# EAGLE design oven (EAGLE 6.1)
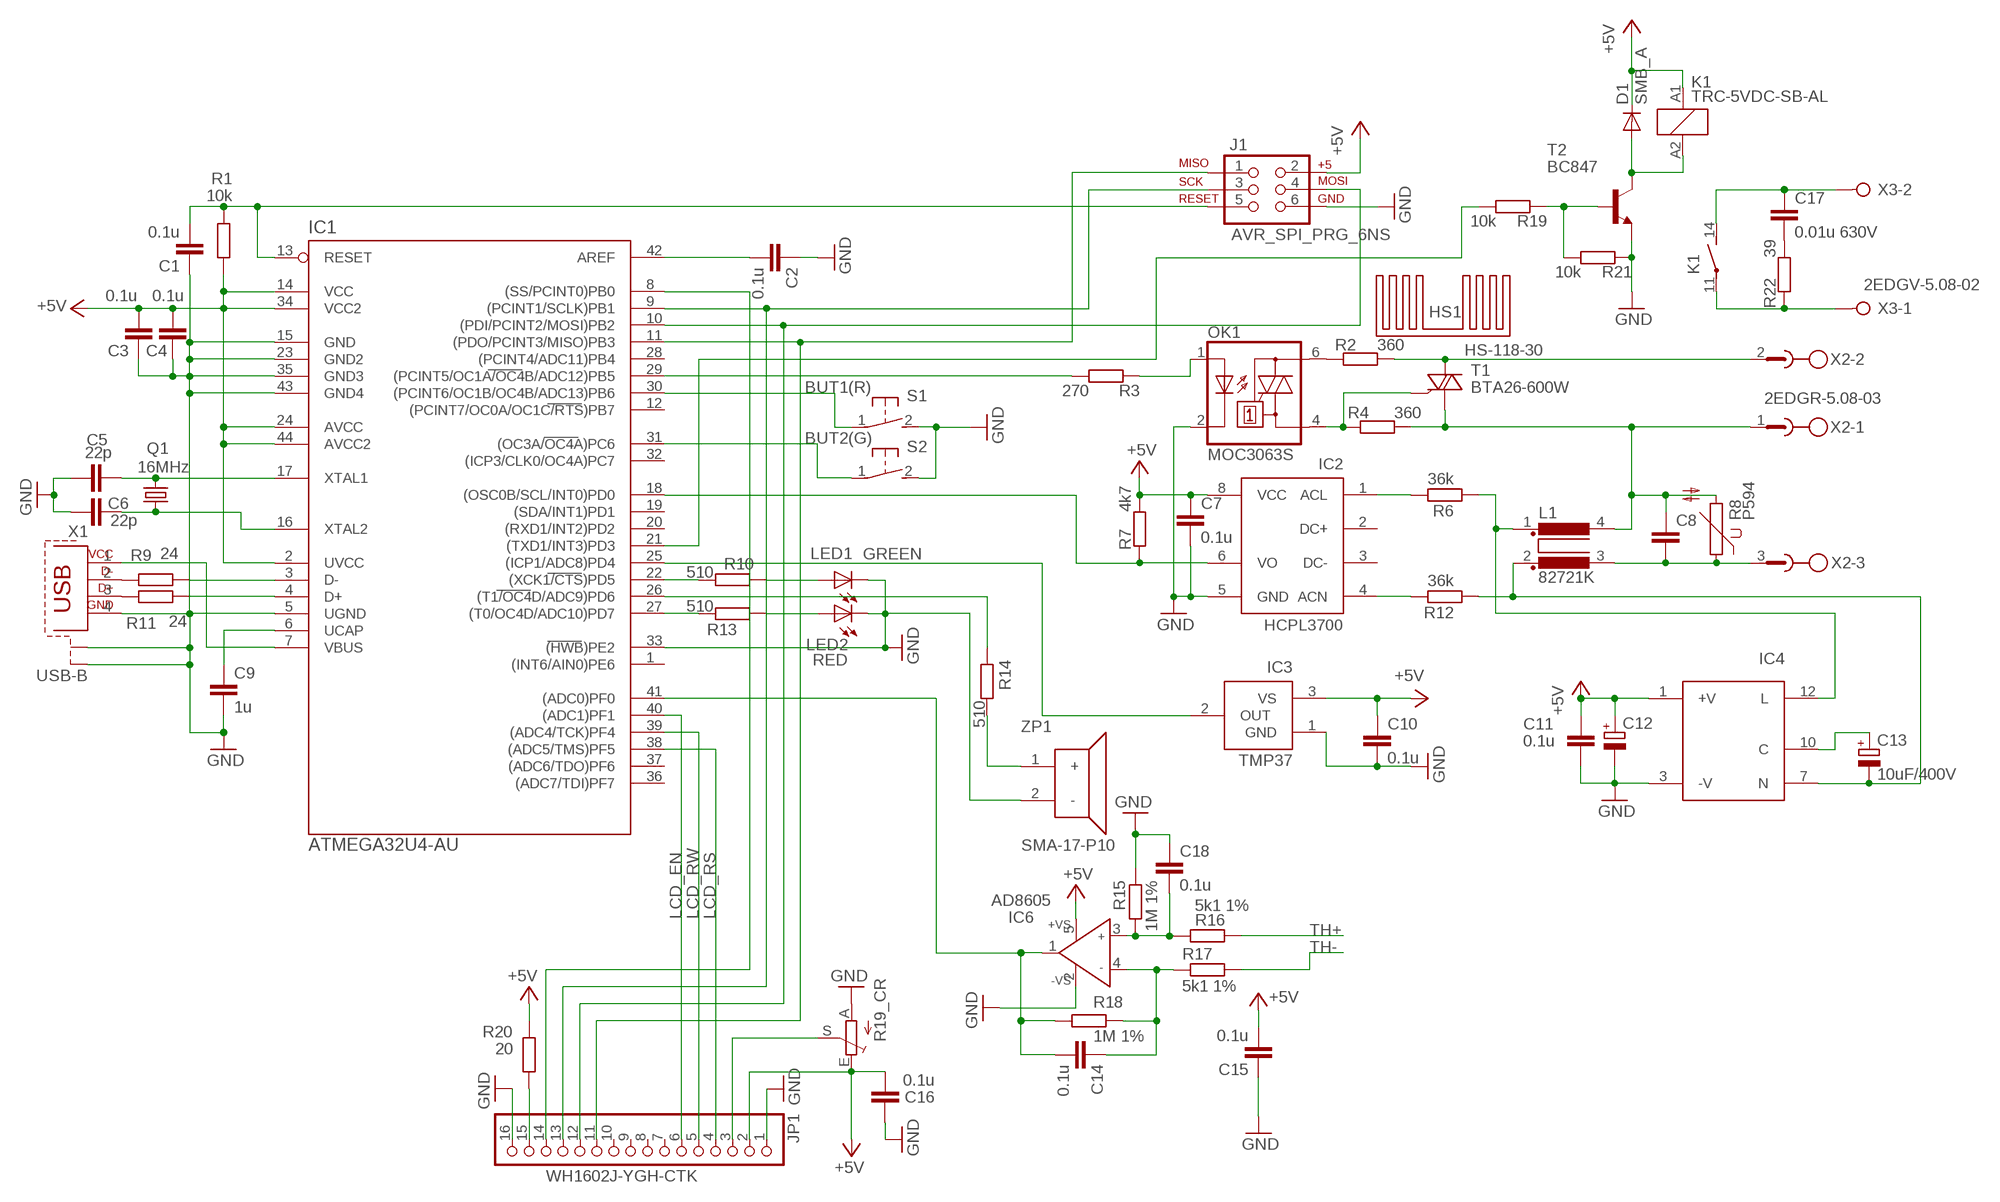
[diagram p0: schematic, sheet 1]

## Parts
C1  0.1u  C-EUC0805R  [C0805R]
C2  0.1u  C-EUC0805R  [C0805R]
C3  0.1u  C-EUC0805R  [C0805R]
C4  0.1u  C-EUC0805R  [C0805R]
C5  22p  C-EUC0805R  [C0805R]
C6  22p  C-EUC0805R  [C0805R]
C7  0.1u  C-EUC0805R  [C0805R]
C8  C-EU102-054X133  [C102-054X133]
C9  1u  C-EUC0805R  [C0805R]
C10  0.1u  C-EUC0805R  [C0805R]
C11  0.1u  C-EUC0805R  [C0805R]
C12  CPOL-EUE3.5-8  [E3,5-8]
C13  10uF/400V  CPOL-EUE5-10.5  [E5-10,5]
C14  0.1u  C-EUC0805R  [C0805R]
C15  0.1u  C-EUC0805R  [C0805R]
C16  0.1u  C-EUC0805R  [C0805R]
C17  0.01u 630V  C-EU102-043X133  [C102-043X133]
C18  0.1u  C-EUC0805R  [C0805R]
D1  SMB_A  DIODE-DO-214AC  [DO-214AC]
HS1  HS-118-30  HS-118  [HS-118]
IC1  ATMEGA32U4-AU  [TQFP44]
IC2  HCPL3700  [DIL08]
IC3  TMP37  TMP36  [TO92]
IC4  PPM2.5-S12-05ELF  [SIP12]
IC6  AD8605  [SOT23-5]
J1  AVR_SPI_PRG_6NS  [2X3-NS]
JP1  WH1602J-YGH-CTK  PINHD-1X16  [1X16]
K1  TRC-5VDC-SB-AL  TRCA  [TRC]
L1  82721K  [82721K]
LED1  GREEN  LED3MM  [LED3MM]
LED2  RED  LED3MM  [LED3MM]
OK1  MOC3063S  MOC3043S  [DIL6-SMD]
Q1  16MHz  CRYSTALHC49S  [HC49/S]
R1  10k  R-EU_R0805R  [R0805R]
R2  360  R-EU_R2512  [R2512]
R3  270  R-EU_R0805R  [R0805R]
R4  360  R-EU_R2512  [R2512]
R6  36k  R-EU_R1206R  [R1206R]
R7  4k7  R-EU_R0805R  [R0805R]
R8  P594  [P594]
R9  24  R-EU_R0805R  [R0805R]
R10  510  R-EU_R0805R  [R0805R]
R11  24  R-EU_R0805R  [R0805R]
R12  36k  R-EU_R1206R  [R1206R]
R13  510  R-EU_R0805R  [R0805R]
R14  510  R-EU_R0805R  [R0805R]
R15  1M 1%  R-EU_R0805R  [R0805R]
R16  5k1 1%  R-EU_R0805R  [R0805R]
R17  5k1 1%  R-EU_R0805R  [R0805R]
R18  1M 1%  R-EU_R0805R  [R0805R]
R19  10k  R-EU_R0805R  [R0805R]
R19_CR  TRIM_EU-CA6V  [CA6V]
R20  20  R-EU_R0805R  [R0805R]
R21  10k  R-EU_R0805R  [R0805R]
R22  39  R-EU_0207/5V  [0207/5V]
S1  31-XX  [B3F-31XX]
S2  31-XX  [B3F-31XX]
T1  BTA26-600W  BTA26-V  [TOP3S-1]
T2  BC847  [SOT23]
X1  USB-B  [PN61729-S]
X2  2EDGR-5.08-03  W232-3  [W232-3]
X3  2EDGV-5.08-02  W237-02P  [W237-132]
ZP1  SMA-17-P10  [SMA-17]

## Nets
+5V: C3.2 C4.2 C7.1 C10.1 C11.1 C12.+ C15.2 C16.2 D1.C IC1.2(UVCC) IC1.14(VCC) IC1.24(AVCC) IC1.34(VCC2) IC1.44(AVCC2) IC2.8(VCC) IC3.3(VS) IC4.1(+V) IC6.5(+VS) J1.2 JP1.2 K1.A1 R1.1 R7.2 R19_CR.E R20.1
BUT1(R): IC1.30((PCINT6/OC1B/OC4B/ADC13)PB6) S1.1(P)
BUT2(G): IC1.31((OC3A/OC4A)PC6) S2.1(P)
GND: C1.1 C2.1 C3.1 C4.1 C5.1 C6.1 C7.2 C9.2 C10.2 C11.2 C12.- C15.1 C16.1 C18.1 IC1.5(UGND) IC1.15(GND) IC1.23(GND2) IC1.33((HWB)PE2) IC1.35(GND3) IC1.43(GND4) IC2.5(GND) IC3.1(GND) IC4.3(-V) IC6.2(-VS) J1.6 JP1.1 JP1.16 LED1.K(C) LED2.K(C) OK1.2(C) R15.2 R19_CR.A R21.1 S1.2(S) S2.2(S) T2.2(E) X1.4 X1.S1 X1.S2 ZP1.2(-)
LCD_D4: IC1.11((PDO/PCINT3/MISO)PB3) J1.1 JP1.11
LCD_D5: IC1.10((PDI/PCINT2/MOSI)PB2) J1.4 JP1.12
LCD_D6: IC1.9((PCINT1/SCLK)PB1) J1.3 JP1.13
LCD_D7: IC1.8((SS/PCINT0)PB0) JP1.14
LCD_EN: IC1.40((ADC1)PF1) JP1.6
LCD_RS: IC1.38((ADC5/TMS)PF5) JP1.4
LCD_RW: IC1.39((ADC4/TCK)PF4) JP1.5
N$1: C9.1 IC1.6(UCAP)
N$2: R9.1 X1.2
N$3: R11.1 X1.3
N$4: IC1.3(D-) R9.2
N$5: IC1.4(D+) R11.2
N$6: IC1.7(VBUS) X1.1
N$7: IC1.18((OSC0B/SCL/INT0)PD0) IC2.6(VO) R7.1
N$8: C5.2 IC1.17(XTAL1) Q1.2
N$9: C6.2 IC1.16(XTAL2) Q1.1
N$10: IC1.29((PCINT5/OC1A/OC4B/ADC12)PB5) R3.2
N$11: C1.2 IC1.13(RESET) J1.5 R1.2
N$12: C2.2 IC1.42(AREF)
N$13: C17.2 R22.2
N$16: OK1.1(A) R3.1
N$17: OK1.6(A2) R2.1
N$18: OK1.4(A1) R4.1 T1.G
N$19: R2.2 T1.A2 X2.2
N$20: IC4.12(L) L1.1 R6.1
N$21: JP1.15 R20.2
N$22: IC1.25((ICP1/ADC8)PD4) IC3.2(OUT)
N$23: IC2.4(ACN) R12.2
N$25: C14.2 IC1.41((ADC0)PF0) IC6.1(OUT) R18.1
N$26: C18.2 IC6.3(IN+) R15.1 R16.1
N$27: C14.1 IC6.4(IN-) R17.1 R18.2
N$29: IC2.1(ACL) R6.2
N$30: LED1.A R10.1
N$31: C13.+ IC4.10(C)
N$32: IC1.22((XCK1/CTS)PD5) R10.2
N$33: IC1.26((T1/OC4D/ADC9)PD6) R14.1
N$34: IC1.27((T0/OC4D/ADC10)PD7) R13.2
N$36: LED2.A R13.1
N$37: C13.- IC4.7(N) L1.2 R12.1
N$38: C8.1 L1.4 R4.2 R8.2 T1.A1 X2.1
N$39: C8.2 L1.3 R8.1 X2.3
N$40: JP1.3 R19_CR.S
N$42: D1.A K1.A2 T2.3(C)
N$43: R19.1 R21.2 T2.1(B)
N$44: R14.2 ZP1.1(+)
N$45: C17.1 K1.14(2:S) X3.2
N$46: IC1.21((TXD1/INT3)PD3) R19.2
N$47: K1.11(2:P) R22.1 X3.1
TH+: R16.2
TH-: R17.2
Unconnected: IC1.1((INT6/AIN0)PE6) IC1.12((PCINT7/OC0A/OC1C/RTS)PB7) IC1.19((SDA/INT1)PD1) IC1.20((RXD1/INT2)PD2) IC1.28((PCINT4/ADC11)PB4) IC1.32((ICP3/CLK0/OC4A)PC7) IC1.36((ADC7/TDI)PF7) IC1.37((ADC6/TDO)PF6) IC2.2(DC+) IC2.3(DC-) JP1.7 JP1.8 JP1.9 JP1.10

## Library data of the parts
C1-C11 C14-C18 = olegart-passive:C-EU: CAPACITOR, European symbol
C12 C13 = olegart-passive:CPOL-EU: POLARIZED CAPACITOR, European symbol
D1 = diode:DIODE-: DIODE
HS1 = heatsinks:HS-118: Kinsten HS-118 heatsink
IC1 = mega32U4:ATMEGA32U4-AU
IC2 = olegart-ic:HCPL3700: AC/DC to Logic Interface Optocoupler
IC3 = olegart-ic:TMP36: TMP36 temperature sensor
IC4 = olegart-ic:PPM2.5-S12-05ELF: Peak PPM2.5-S12-05ELF AC/DC conerter, 5V 500mA
IC6 = olegart-ic:AD8605: High Gain Bandwidth, Precision Fast FET(TM) Op Amp Source: http://www.analog.com/UploadedFiles/Data_Sheets/346131962AD8067_a.pdf
J1 = olegart-connectors:AVR_SPI_PRG_6: AVR ISP 6 Pin This is the reduced ISP connector for AVR programming. Common on Arduino. This footprint will take up less PCB space and can be used with a 10-pin to 6-pin adapter such as SKU: BOB-08508
JP1 = pinhead:PINHD-1X16: PIN HEADER
K1 = olegart-relays:TRC: TRC-5VDC-SB-AL (TS)
L1 = inductors:82721K: FILTER
LED1 LED2 = olegart-opto:LED: LED OSRAM: - CHIPLED LG R971, LG N971, LY N971, LG Q971, LY Q971, LO R971, LY R971 LH N974, LH R974 LS Q976, LO Q976, LY Q976 LO Q996 - Hyper CHIPLED LW Q18S LB Q993, LB Q99A, LB R99A - SideLED LS A670, LO A670, LY A670, LG A670, LP A670 LB A673, LV A673, LT A673, LW A673 LH A674 LY A675 LS A676, LA A676, LO A676, LY A676, LW A676 LS A679, LY A679, LG A679 - Hyper Micro SIDELED® LS Y876, LA Y876, LO Y876, LY Y876 LT Y87S - SmartLED LW L88C, LW L88S LB L89C, LB L89S, LG L890 LS L89K, LO L89K, LY L89K LS L896, LA L896, LO L896, LY L896 - TOPLED LS T670, LO T670, LY T670, LG T670, LP T670 LSG T670, LSP T670, LSY T670, LOP T670, LYG T670 LG T671, LOG T671, LSG T671 LB T673, LV T673, LT T673, LW T673 LH T674 LS T676, LA T676, LO T676, LY T676, LB T676, LH T676, LSB T676, LW T676 LB T67C, LV T67C, LT T67C, LS T67K, LO T67K, LY T67K, LW E67C LS E67B, LA E67B, LO E67B, LY E67B, LB E67C, LV E67C, LT E67C LW T67C LS T679, LY T679, LG T679 LS T770, LO T770, LY T770, LG T770, LP T770 LB T773, LV T773, LT T773, LW T773 LH T774 LS E675, LA E675, LY E675, LS T675 LS T776, LA T776, LO T776, LY T776, LB T776 LHGB T686 LT T68C, LB T68C - Hyper Mini TOPLED® LB M676 - Mini TOPLED Santana® LG M470 LS M47K, LO M47K, LY M47K Source: http://www.osram.convergy.de LUXEON: - LUMILED® LXK2-PW12-R00, LXK2-PW12-S00, LXK2-PW14-U00, LXK2-PW14-V00 LXK2-PM12-R00, LXK2-PM12-S00, LXK2-PM14-U00 LXK2-PE12-Q00, LXK2-PE12-R00, LXK2-PE12-S00, LXK2-PE14-T00, LXK2-PE14-U00 LXK2-PB12-K00, LXK2-PB12-L00, LXK2-PB12-M00, LXK2-PB14-N00, LXK2-PB14-P00, LXK2-PB14-Q00 LXK2-PR12-L00, LXK2-PR12-M00, LXK2-PR14-Q00, LXK2-PR14-R00 LXK2-PD12-Q00, LXK2-PD12-R00, LXK2-PD12-S00 LXK2-PH12-R00, LXK2-PH12-S00 LXK2-PL12-P00, LXK2-PL12-Q00, LXK2-PL12-R00 Source: www.luxeon.com KINGBRIGHT: KA-3528ASYC Source: www.kingbright.com
OK1 = optocoupler:MOC30*: 6-Pin DIP Zero-Cross Optoisolators Triac Driver Output (250/400 Volt Peak) Source: http://www.fairchildsemi.com/ds/MO/MOC3043-M.pdf; MF: FAIRCHILD SEMICONDUCTOR; MPN: MOC3043SM; OC_FARNELL: 1505441; OC_NEWARK: 78K6091
Q1 = crystal:CRYSTAL: CRYSTAL; OC_FARNELL: 1667008; OC_NEWARK: unknown
R1-R4 R6 R7 R9-R22 = olegart-passive:R-EU_: RESISTOR, European symbol
R8 = varistor:P594: VARISTOR
R19_CR = pot:TRIM_EU-: POTENTIOMETER
S1 S2 = switch-omron:31-XX: OMRON SWITCH; MPN: B3F-3100; OC_FARNELL: 959704; OC_NEWARK: 36M3582
T1 = triac:BTA26: 25A TRIAC Source: http://www.st.com/stonline/products/literature/ds/7470.pdf
T2 = olegart-transistors:BC847: NPN TRANSISTOR
X1 = olegart-connectors:USB-B: B type USB connector; OC_FARNELL: unknown; OC_NEWARK: unknown
X2 = con-wago-508:W232-3: WAGO SREW CLAMP; OC_FARNELL: unknown; OC_NEWARK: unknown
X3 = con-wago-508:W237-02P: WAGO SREW CLAMP; OC_FARNELL: unknown; OC_NEWARK: unknown
ZP1 = olegart-ic:SMA-17: Sonitron buzzer with generator Compatible with SMA-13-P10

## Board
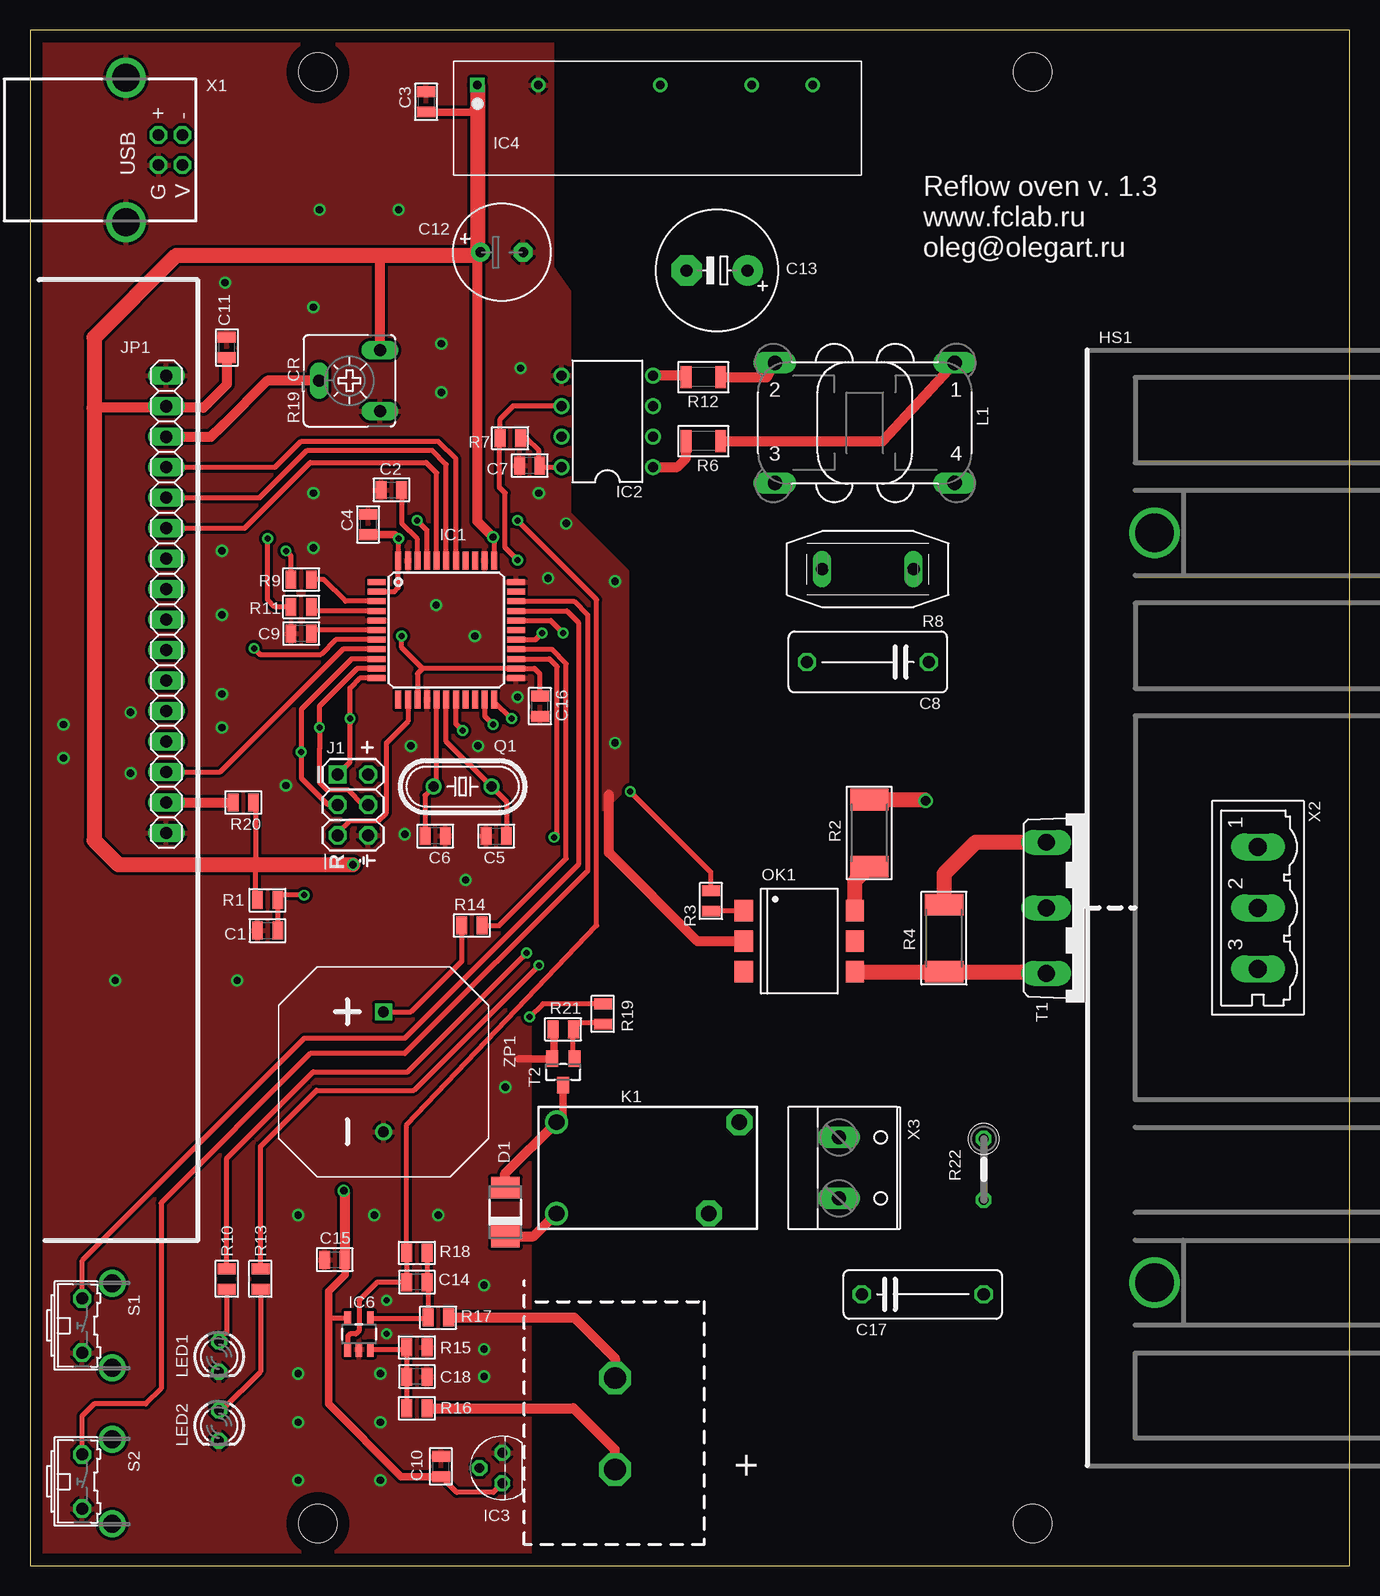
[diagram p1: board, top side]
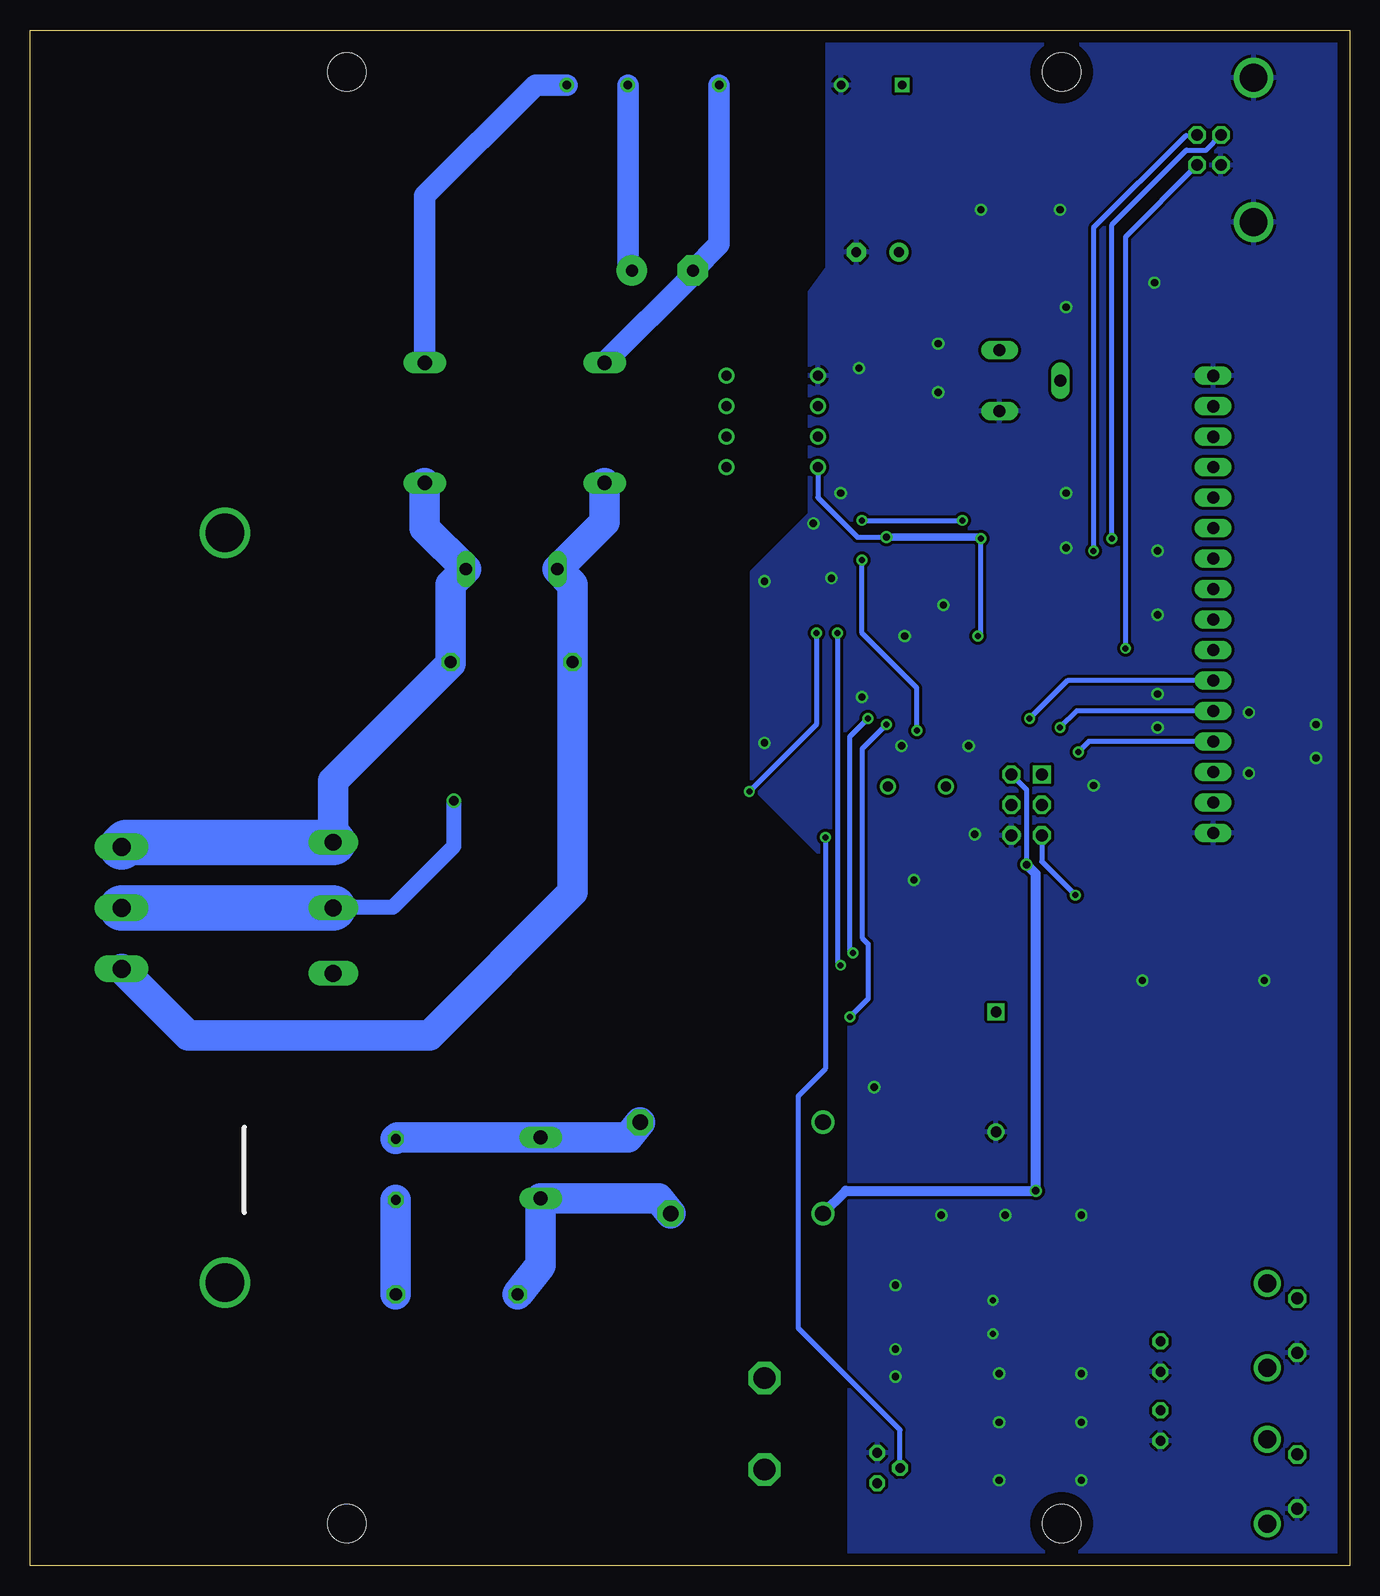
[diagram p2: board, bottom side, seen from below]

Size 110 x 128 mm. Coordinates in mm from the lower left corner, seen from the top.
Outline: 0,0 110,0 110,128 0,128 0,0
Copper layers (1*16): Top 0.035mm / dielectric 1.5mm / Bottom 0.035mm
Design rules: minimum track width 10mil, minimum drill 0.5mm, track to track 0.25mm, track to pad 0.25mm, pad to pad 0.25mm, via to via 0.25mm, smd to smd 0.25mm, copper to edge 40mil, drill to drill 8mil, minimum pad ring 10mil, minimum via ring 8mil, stop-mask expansion 4mil, vias tented up to drill 0.65mm, thermal gap 10mil
Holes 3.2 mm at 24,3.5 24,124.5 83.6,124.5 83.6,3.5

### Footprints (pad centres in the part's own frame; a part is rotated, then mirrored left to right if it is on the bottom)
C0805R = smd 0.9 x 1.5: 1 -0.85,0; 2 0.85,0
C102-054X133 = drill 1.016 octagon: 1 -5.08,0; 2 5.08,0
E3,5-8 = drill 0.813 pad 1.6: + -1.778,0 | drill 0.813 pad 1.6 octagon: - 1.778,0
E5-10,5 = drill 1.016 pad 2.54: + -2.54,0 | drill 1.016 pad 2.54 octagon: - 2.54,0
C102-043X133 = drill 1.016 octagon: 1 -5.08,0; 2 5.08,0
DO-214AC = smd 1.8 x 2.4: A 2.025,0; C -2.025,0
HS-118 = drill 3.2: P$1 -31.25,5.6; P$2 31.25,5.6
TQFP44 = smd 1.5 x 0.5: 1 -5.8,4; 2 -5.8,3.2; 3 -5.8,2.4; 4 -5.8,1.6; 5 -5.8,0.8; 6 -5.8,0; 7 -5.8,-0.8; 8 -5.8,-1.6; 9 -5.8,-2.4; 10 -5.8,-3.2; 11 -5.8,-4; 23 5.8,-4; 24 5.8,-3.2; 25 5.8,-2.4; 26 5.8,-1.6; 27 5.8,-0.8; 28 5.8,0; 29 5.8,0.8; 30 5.8,1.6; 31 5.8,2.4; 32 5.8,3.2; 33 5.8,4 | smd 0.5 x 1.5: 12 -4,-5.8; 13 -3.2,-5.8; 14 -2.4,-5.8; 15 -1.6,-5.8; 16 -0.8,-5.8; 17 0,-5.8; 18 0.8,-5.8; 19 1.6,-5.8; 20 2.4,-5.8; 21 3.2,-5.8; 22 4,-5.8; 34 4,5.8; 35 3.2,5.8; 36 2.4,5.8; 37 1.6,5.8; 38 0.8,5.8; 39 0,5.8; 40 -0.8,5.8; 41 -1.6,5.8; 42 -2.4,5.8; 43 -3.2,5.8; 44 -4,5.8
DIL08 = drill 0.813 pad 1.27: 1 -3.81,-3.81; 2 -1.27,-3.81; 3 1.27,-3.81; 4 3.81,-3.81; 5 3.81,3.81; 6 1.27,3.81; 7 -1.27,3.81; 8 -3.81,3.81
TO92 = drill 0.813 octagon: 1 1.27,0; 2 0,1.905; 3 -1.27,0
SIP12 = drill 0.7 square: 1 2,2 | drill 0.7: 3 7.08,2; 7 17.24,2; 10 24.86,2; 12 29.94,2
SOT23-5 = smd 0.55 x 1.2: 1 -0.95,-1.3; 2 0,-1.3; 3 0.95,-1.3; 4 0.95,1.3; 5 -0.95,1.3
2X3-NS = drill 1.016 square: 1 -2.54,-1.27 | drill 1.016 octagon: 2 -2.54,1.27; 3 0,-1.27; 4 0,1.27; 5 2.54,-1.27; 6 2.54,1.27
1X16 = drill 1.016 long: 1 -19.05,0; 2 -16.51,0; 3 -13.97,0; 4 -11.43,0; 5 -8.89,0; 6 -6.35,0; 7 -3.81,0; 8 -1.27,0; 9 1.27,0; 10 3.81,0; 11 6.35,0; 12 8.89,0; 13 11.43,0; 14 13.97,0; 15 16.51,0; 16 19.05,0
TRC = drill 1.3 pad 2.184 octagon: 11 7.62,3.8; 14 5.08,-3.8 | drill 1.3: A1 -7.62,-3.8; A2 -7.62,3.8
82721K = drill 1.194 long: 1 7.493,5.004; 2 -7.493,5.004; 3 -7.493,-5.004; 4 7.493,-5.004
LED3MM = drill 0.813 octagon: A -1.27,0; K 1.27,0
DIL6-SMD = smd 1.78 x 1.52: 1 -2.54,-4.645; 2 0,-4.645; 3 2.54,-4.645; 4 2.54,4.645; 5 0,4.645; 6 -2.54,4.645
HC49/S = drill 0.813: 1 -2.413,0; 2 2.413,0
R0805R = smd 0.9 x 1.5: 1 -0.85,0; 2 0.85,0
R2512 = smd 1.8 x 3.2: 1 -2.8,0; 2 2.8,0
R1206R = smd 0.9 x 1.8: 1 -1.45,0; 2 1.45,0
P594 = drill 1.016 long: 1 0,3.81; 2 0,-3.81
CA6V = drill 1.016 long: A -2.54,-2.54; E 2.54,-2.54; S 0,2.54
0207/5V = drill 0.813 octagon: 1 -2.54,0; 2 2.54,0
B3F-31XX = drill 1.016 octagon: 1 -2.261,-1.245; 2 2.261,-1.245 | drill 1.499 pad 2.159: 3 -3.505,1.245; 4 3.505,1.245
TOP3S-1 = drill 1.397 long: A1 -5.461,-3.175; A2 0,-3.175; G 5.461,-3.175
SOT23 = smd 1 x 1.4: 1 -0.95,-1.1; 2 0.95,-1.1; 3 0,1.1
PN61729-S = drill 0.95 octagon: 1 1.25,4.71; 2 -1.25,4.71; 3 -1.25,2.71; 4 1.25,2.71 | drill 2.3 pad 2.9: S1 -6.02,0; S2 6.02,0
W232-3 = drill 1.5 long: 1 -5.08,-0.635; 2 0,-0.635; 3 5.08,-0.635
W237-132 = drill 1.194 long: 1 -2.54,-0.635; 2 2.54,-0.635
SMA-17 = drill 0.9 square: 1 -5,0 | drill 0.9: 2 5,0

### Placement (x,y rotation side)
C1  19.81,52.93 0 top
C2  30.13,89.66 0 top
C3  33.02,122.01 270 top
C4  28.19,86.78 270 top
C5  38.86,60.8 0 top
C6  33.78,60.8 180 top
C7  41.66,91.69 180 top
C8  69.85,75.31 180 top
C9  22.61,77.69 180 top
C10  34.26,8.26 90 top
C11  16.41,101.54 90 top
C12  39.34,109.47 0 top
C13  57.28,107.95 180 top
C14  32.26,23.62 180 top
C15  25.4,25.49 0 top
C16  42.51,71.63 90 top
C17  74.42,22.61 0 top
C18  32.26,15.75 180 top
D1  39.62,29.46 90 top
HS1  88.14,54.82 270 top
IC1  34.7,77.98 0 top
IC2  48.13,95.38 90 top
IC3  39.37,8.13 90 top
IC4  35.31,121.41 0 top
IC6  27.43,19.3 0 top
J1  26.92,63.41 270 top
JP1  11.37,80.12 270 top
K1  51.51,33.15 0 top
L1  69.6,95.25 0 top
LED1  15.76,17.41 270 top
LED2  15.76,11.66 270 top
OK1  64.14,52.04 270 top
Q1  36.07,64.93 0 top
R1  19.81,55.47 0 top
R2  69.98,61.05 90 top
R3  56.77,55.39 90 top
R4  76.2,52.29 90 top
R6  56.13,93.73 180 top
R7  40.04,93.98 0 top
R8  69.85,83.06 90 top
R9  22.61,82.2 0 top
R10  16.42,23.88 90 top
R11  22.61,79.92 0 top
R12  56.13,99.06 180 top
R13  19.21,23.88 90 top
R14  36.83,53.34 180 top
R15  32.26,18.19 0 top
R16  32.26,13.11 0 top
R17  34.04,20.67 0 top
R18  32.26,26.07 0 top
R19  47.75,45.97 90 top
R19_CR  26.64,98.77 90 top
R20  17.78,63.59 180 top
R21  44.45,44.7 0 top
R22  79.5,33.02 270 top
S1  5.6,20 270 top
S2  5.6,7 270 top
T1  87.89,54.82 270 top
T2  44.45,41.15 180 top
X1  8,118 270 top
X2  103,54.82 270 top
X3  68.07,33.15 270 top
ZP1  29.46,41.15 270 top

### Tracks (layer width: path | path; a pad name or v marks a point on that pad's centre or on a via)
+5V  (via drill 0.5, 0.6)
  Top 0.406: IC1.2 30.38,81.18 30.7,81.5 IC1.44 30.7,85.57 v30.73,85.6 | v38.61,85.72 38.7,85.63 IC1.34 | 32.74,74.78 IC1.24 42.06,74.78 42.51,74.33 C16.2 | 32.74,74.78 32.3,74.34 IC1.14 | R7.2 41.4,93.98 42.42,92.96 42.42,91.78 C7.1 42.63,91.57 IC2.8 | 32.74,74.78 30.99,76.53 v30.99,77.47 | IC3.3 38.61,6.1 35.57,6.1 C10.1 | IC6.5 24.89,20.6 24.89,13.72 | R1.1 18.8,55.63 18.8,58.42 18.8,63.43 R20.1
  Top 0.61: C3.2 37.06,121.16 37.31,121.41 | C4.2 30.4,85.93 30.76,85.57 30.7,85.57 | C15.2 26.25,24.22 24.89,22.86 24.89,13.72 24.89,13.46 30.95,7.41 C10.1
  Top 0.813: v38.61,85.72 37.3,87.03 37.3,109.19 37.34,109.22 | D1.C 41.98,27.44 K1.A1 | C15.2 26.25,31.15 v26.16,31.24 | C11.1 16.41,98.46 14.48,96.52 11.48,96.52 JP1.2 11.26,96.52 5.33,96.52 | R19_CR.E 29.18,109.19 29.21,109.22
  Top 1.27: IC4.1 37.31,121.41 37.31,109.73 C12.+ 37.59,109.47 37.34,109.22 29.21,109.22 12.19,109.22 5.33,102.36 5.33,96.52 5.33,60.45 7.37,58.42 18.8,58.42 v26.92,58.42
  Bottom 0.406: J1.2 26.92,64.68 v26.92,58.42 | v30.99,77.47 30.73,77.72 v30.73,85.6 | IC2.8 44.32,89.03 41.02,85.72 v38.61,85.72
  Bottom 0.61: v38.61,85.72 30.86,85.72 v30.73,85.6
  Bottom 0.813: v26.92,58.42 26.16,57.66 v26.16,31.24 42,31.24 K1.A1
BUT1(R)
  Top 0.406: IC1.30 44.76,79.58 45.72,78.61 45.72,58.42 31.24,43.94 22.86,43.94 4.36,25.44 S1.1
BUT2(G)
  Top 0.406: IC1.31 45.35,80.38 46.48,79.25 46.48,57.91 31.24,42.67 23.37,42.67 10.92,30.23 10.92,14.73 9.65,13.46 5.33,13.46 4.32,12.45 4.32,10.25 S2.1
GND  (via drill 0.5, 0.6)
  Top 0.406: T2.2 43.69,42.44
  Top 0.61: 43.69,42.44 43.69,44.62 R21.1 | T2.2 40.72,42.25
  Top 0.813: OK1.2 55.66,52.04 48.26,59.44 48.26,64.26
  other vias: 7.11,48.77 17.27,48.77 22.35,29.21 22.35,11.94 29.21,11.94 28.7,29.21 37.85,18.03 16,84.58 16,79.25 23.62,84.84 23.62,89.41 33.85,80.07 44.7,86.87 48.77,82.04 43.18,82.3 34.29,101.85 34.29,97.79 40.89,99.82 23.62,104.9 16.26,106.93 24.13,113.03 30.73,113.03 34.04,29.21 48.77,68.58 42.42,89.41 29.21,16 22.35,16 36.32,57.15 31.24,60.96 31.75,68.33 37.34,68.33 40.64,72.39 37.08,77.47 16,72.64 16,69.85 21.34,65.02 2.79,67.31 2.79,70.1 8.38,71.12 8.38,66.04 39.62,39.88 22.35,7.11 29.21,7.11 37.85,23.37 37.85,15.75 29.72,19.3 29.72,22.1
  pour Bottom: 0.51,127.51 0.51,0.51 41.66,0.51 41.66,56.9 49.78,65.02 49.78,82.8 44.96,87.63 44.96,106.17 43.5,108.2 43.5,127.51
  pour Top: 0,127.51 0,0.51 41.66,0.51 41.66,56.9 49.78,65.02 49.78,82.8 44.96,87.63 44.96,106.17 43.5,108.2 43.5,127.51
LCD_D4  (via drill 0.5)
  Top 0.406: IC1.11 27.5,73.98 26.67,73.15 v26.67,70.61 26.67,70.1 26.67,66.96 J1.1
  Bottom 0.406: 25.65,66.04 J1.1 | JP1.11 23.51,73.77 v26.67,70.61
LCD_D5  (via drill 0.5)
  Top 0.406: J1.4 27.78,63.41 26.54,64.64 24.77,64.64 24.13,65.28 24.13,68.07 v24.13,69.85 24.13,71.63 27.28,74.78 IC1.10
  Bottom 0.406: JP1.12 22.75,71.23 v24.13,69.85
LCD_D6  (via drill 0.5)
  Top 0.406: J1.3 24.86,63.41 22.61,65.66 22.61,67.31 v22.61,67.82 22.61,71.37 26.81,75.58 IC1.9
  Bottom 0.406: JP1.13 21.73,68.69 v22.61,67.82
LCD_D7
  Top 0.406: IC1.8 26.09,76.38 15.86,66.15 JP1.14
LCD_EN
  Top 0.406: JP1.6 17.89,86.47 23.37,91.95 33.02,91.95 33.9,91.06 IC1.40
LCD_RS
  Top 0.406: JP1.4 20.43,91.55 22.61,93.73 34.04,93.73 35.5,92.26 IC1.38
LCD_RW
  Top 0.406: JP1.5 19.16,89.01 23.11,92.96 33.53,92.96 34.7,91.79 IC1.39
N$1
  Top 0.406: IC1.6 23.74,77.98 C9.1
N$2  (via drill 0.5)
  Top 0.406: v21.34,84.58 21.76,84.16 R9.1
  Bottom 0.406: v21.34,84.58 21.34,111.51 13.64,119.2 X1.2
N$3  (via drill 0.5)
  Top 0.406: R11.1 20.41,79.92 19.81,80.52 v19.81,85.6
  Bottom 0.406: v19.81,85.6 19.81,111.76 13.59,117.98 11.93,117.98 X1.3
N$4
  Top 0.406: IC1.3 26.3,80.38 24.48,82.2 R9.2
N$5
  Top 0.406: IC1.4 23.89,79.58 R11.2
N$6  (via drill 0.5)
  Top 0.406: v18.67,76.45 19.18,75.95 24.26,75.95 25.49,77.18 IC1.7
  Bottom 0.406: X1.1 18.67,110.74 v18.67,76.45
N$7  (via drill 0.5)
  Top 0.406: IC2.6 40.26,96.65 39.19,95.58 R7.1 39.12,93.91 39.12,89.92 39.62,89.41 39.62,84.84 v40.64,83.82 | v36.07,69.6 35.5,70.16 IC1.18
  Bottom 0.406: v36.07,69.6 36.07,73.15 40.64,77.72 v40.64,83.82
N$8
  Top 0.406: IC1.17 34.7,68.71 Q1.2 39.71,63.7 C5.2
N$9
  Top 0.406: IC1.16 33.9,65.18 Q1.1 32.93,64.21 C6.2
N$10  (via drill 0.5)
  Top 0.406: IC1.29 43.4,78.78 v44.45,77.72 | v50.04,64.52 56.77,57.79 R3.2
  Bottom 0.406: v44.45,77.72 44.45,70.1 v50.04,64.52
N$11  (via drill 0.5)
  Top 0.406: J1.5 25.65,61.09 26.67,62.1 29.08,62.1 29.72,62.74 29.72,68.58 31.5,70.37 IC1.13 | C1.2 R1.2 21.08,55.88 v22.86,55.88
  Bottom 0.406: J1.5 25.65,58.67 v22.86,55.88
N$12
  Top 0.406: IC1.42 32.3,85.55 30.98,86.87 C2.2
N$13
  Bottom 2.54: R22.2 C17.2
N$16
  Top 0.254: R3.1 57.15,54.61 57.15,54.58
  Top 0.406: OK1.1 57.15,54.58 56.93,54.58 56.9,54.61
N$17
  Top 0.254: 69.85,58.17 69.85,58.42 R2.1
  Top 1.27: OK1.6 68.78,57.1 69.85,58.17
N$18
  Top 0.254: T1.G 85.09,49.53 84.62,49.49
  Top 1.27: 84.84,49.53 84.62,49.49 R4.1 75.94,49.5 OK1.4
N$19  (via drill 0.8)
  Top 1.27: R2.2 74.58,63.85 v74.68,63.75
  Bottom 1.27: v74.68,63.75 74.68,59.94 79.76,54.86 84.68,54.86 T1.A2
  Bottom 3.81: T1.A2 X2.2
N$20
  Top 0.813: R6.1 71.07,93.73 L1.1
  Bottom 1.778: IC4.12 67.85,123.41 77.09,114.17 L1.1
N$21
  Top 0.813: JP1.15 16.91,63.61 R20.2
N$22  (via drill 0.5)
  Top 0.406: IC1.25 43.29,75.58 43.94,74.93 43.94,60.96 v43.69,60.71
  Bottom 0.406: IC3.2 37.47,11.3 45.97,19.81 45.97,39.12 43.69,41.4 v43.69,60.71
N$23
  Top 0.813: R12.2 54.56,99.19 IC2.4
N$25  (via drill 0.5)
  Top 0.406: v32.26,87.12 33.1,86.28 IC1.41 | IC6.1 26.48,19.12 26.67,19.3 27.18,19.3 27.43,19.56 27.43,22.1 28.96,23.62 C14.2 R18.1 31.41,36.74 47.24,53.34 47.24,80.52 v40.64,87.12
  Bottom 0.406: v40.64,87.12 v32.26,87.12
N$26
  Top 0.406: IC6.3 31.41,18 | 31.41,18 R15.1 | 31.41,18 C18.2 R16.1
N$27
  Top 0.406: R18.2 C14.1 33.19,23.62 R17.1 33.19,20.6 IC6.4
N$29
  Top 0.813: IC2.1 53.98,91.57 54.68,92.28 R6.2
N$30
  Top 0.406: LED1.A 15.76,18.81 16.42,19.46 R10.1
N$31
  Bottom 1.778: IC4.10 60.17,108.55 C13.+
N$32  (via drill 0.5)
  Top 0.406: R10.2 16.42,33.94 23.62,41.15 31.5,41.15 v41.4,51.05 | IC1.22 38.7,72.04 v40.13,70.61
  Bottom 0.406: v41.4,51.05 41.66,51.31 41.66,69.09 v40.13,70.61
N$33
  Top 0.406: IC1.26 43.51,76.38 44.7,75.18 44.7,58.93 39.12,53.34 R14.1
N$34  (via drill 0.5)
  Top 0.406: R13.2 19.21,34.96 23.88,39.62 32,39.62 v42.42,50.04 | IC1.27 42.13,77.18 v42.67,77.72
  Bottom 0.406: v42.67,77.72 42.67,50.29 v42.42,50.04
N$36
  Top 0.406: LED2.A 15.98,12.93 19.21,16.16 R13.1
N$37
  Top 0.813: R12.1 61.42,99.06 L1.2
  Bottom 1.778: IC4.7 52.55,110.14 C13.- 54.74,107.62 L1.2
N$38
  Top 1.27: T1.A1 78.83,60.28 76.2,57.66 R4.2
  Bottom 2.54: T1.A1 84.72,65.39 74.93,75.18 C8.1 74.93,81.79 R8.2 77.09,86.49 L1.4
  Bottom 3.81: T1.A1 101.98,60.28 X2.1
N$39
  Bottom 2.54: L1.3 62.1,87 R8.1 64.77,81.79 C8.2 64.77,56.13 76.71,44.2 96.82,44.2 X2.3
N$40
  Top 0.813: R19_CR.S 19.77,98.77 16.13,95.12 16,95 15.1,94.09 JP1.3
N$42
  Top 0.61: K1.A2 44.45,37.5 T2.3
  Top 0.813: D1.A 39.62,32.68 K1.A2
N$43
  Top 0.406: T2.1 45.21,42.44 45.21,44.62 R21.2 45.81,45.21 47.66,45.21 R19.1
N$44
  Top 0.406: ZP1.1 31.76,46.15 35.98,50.37 R14.2
N$45
  Bottom 2.54: K1.14 57.6,30.61 X3.2 67.44,25.02 C17.1
N$46  (via drill 0.5)
  Top 0.406: IC1.21 37.9,70.81 v38.61,70.1 | v41.66,45.72 42.76,46.82 R19.2
  Bottom 0.406: v38.61,70.1 40.64,68.07 40.64,52.32 40.13,51.82 40.13,47.24 v41.66,45.72
N$47
  Bottom 2.54: K1.11 60.14,35.69 X3.1 79.37,35.69 R22.1
TH+  (via drill 1.8)
  Top 0.813: R16.2 45.31,13.11 48.77,9.65 v48.77,8
TH-  (via drill 1.8)
  Top 0.813: R17.2 45.37,20.67 48.77,17.27 v48.77,15.62

### Text on the board
tPlace: Reflow oven v. 1.3 | www.fclab.ru | oleg@olegart.ru | +